# EAGLE design PlacaAquisicao (EAGLE 9.6.2)

## Sheet 1 of 2
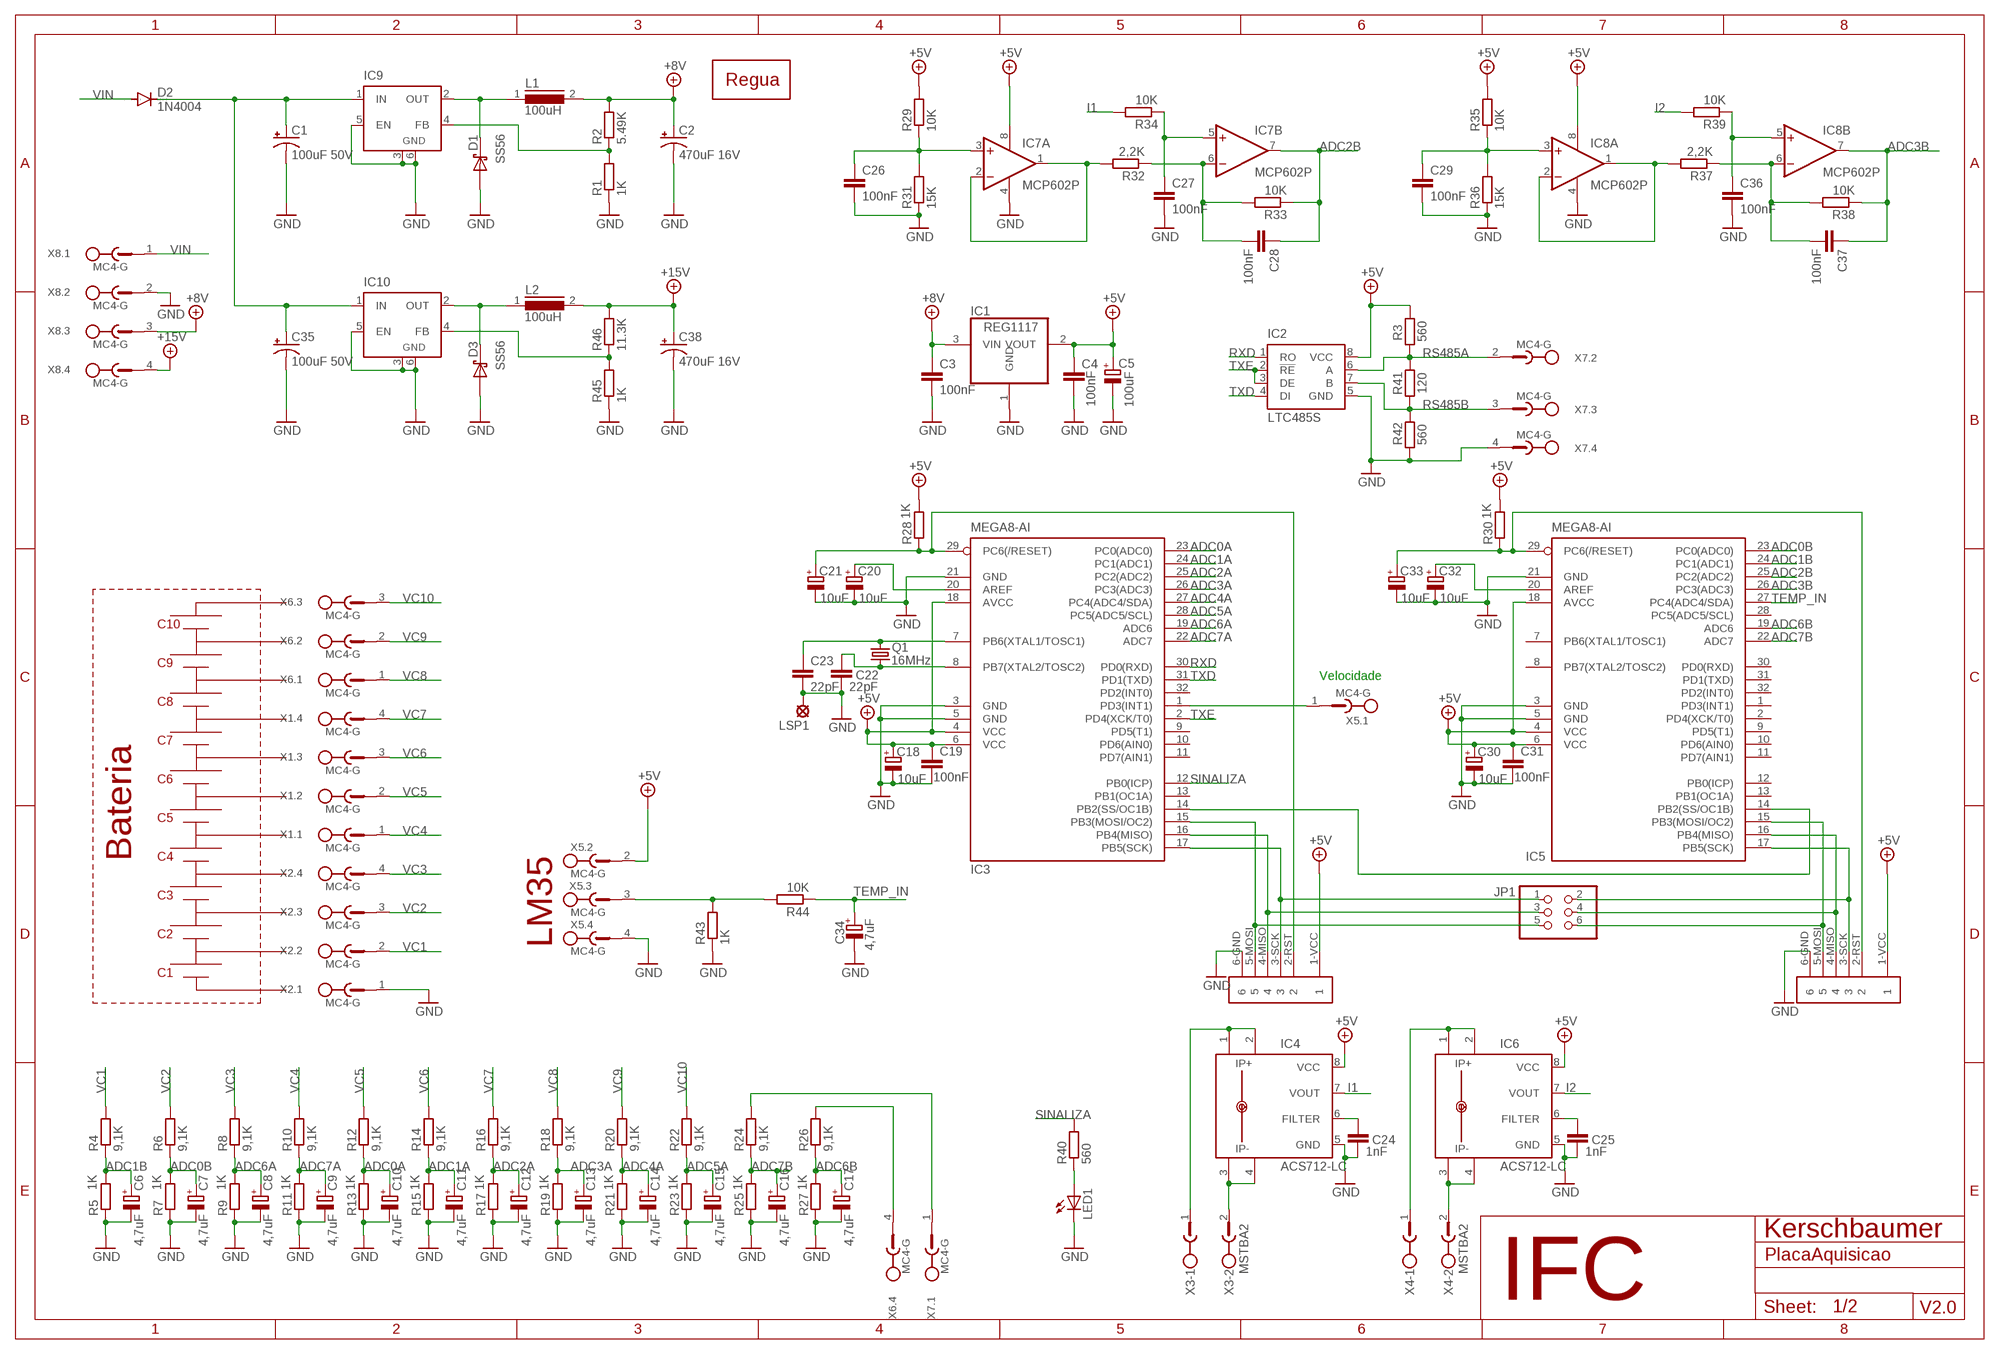
[diagram p0: schematic, sheet 1]

### Parts
C1  100uF 50V  CPOL-USE2.5-7  [E2,5-7]
C2  470uF 16V  CPOL-USE2.5-7  [E2,5-7]
C3  100nF  C-EU050-025X075  [C050-025X075]
C4  100nF  C-EU050-025X075  [C050-025X075]
C5  100uF  CPOL-EUE2.5-6  [E2,5-6]
C6  4,7uF  CPOL-EUE2.5-6  [E2,5-6]
C7  4,7uF  CPOL-EUE2.5-6  [E2,5-6]
C8  4,7uF  CPOL-EUE2.5-6  [E2,5-6]
C9  4,7uF  CPOL-EUE2.5-6  [E2,5-6]
C10  4,7uF  CPOL-EUE2.5-6  [E2,5-6]
C11  4,7uF  CPOL-EUE2.5-6  [E2,5-6]
C12  4,7uF  CPOL-EUE2.5-6  [E2,5-6]
C13  4,7uF  CPOL-EUE2.5-6  [E2,5-6]
C14  4,7uF  CPOL-EUE2.5-6  [E2,5-6]
C15  4,7uF  CPOL-EUE2.5-6  [E2,5-6]
C16  4,7uF  CPOL-EUE2.5-6  [E2,5-6]
C17  4,7uF  CPOL-EUE2.5-6  [E2,5-6]
C18  10uF  CPOL-EUE2.5-6  [E2,5-6]
C19  100nF  C-EU050-025X075  [C050-025X075]
C20  10uF  CPOL-EUE2.5-6  [E2,5-6]
C21  10uF  CPOL-EUE2.5-6  [E2,5-6]
C22  22pF  C-EU025-025X050  [C025-025X050]
C23  22pF  C-EU025-025X050  [C025-025X050]
C24  1nF  C-EU025-025X050  [C025-025X050]
C25  1nF  C-EU025-025X050  [C025-025X050]
C26  100nF  C-EU050-025X075  [C050-025X075]
C27  100nF  C-EU050-025X075  [C050-025X075]
C28  100nF  C-EU050-025X075  [C050-025X075]
C29  100nF  C-EU050-025X075  [C050-025X075]
C30  10uF  CPOL-EUE2.5-6  [E2,5-6]
C31  100nF  C-EU050-025X075  [C050-025X075]
C32  10uF  CPOL-EUE2.5-6  [E2,5-6]
C33  10uF  CPOL-EUE2.5-6  [E2,5-6]
C34  4,7uF  CPOL-EUE2.5-6  [E2,5-6]
C35  100uF 50V  CPOL-USE2.5-7  [E2,5-7]
C36  100nF  C-EU050-025X075  [C050-025X075]
C37  100nF  C-EU050-025X075  [C050-025X075]
C38  470uF 16V  CPOL-USE2.5-7  [E2,5-7]
D1  SS56  DIODE-SCHOTTKY_  [SMA-DIODE]
D2  1N4004  [DO41-10]
D3  SS56  DIODE-SCHOTTKY_  [SMA-DIODE]
IC1  REG1117  [SOT223]
IC2  LTC485S  [SOIC8]
IC3  MEGA8-AI  [TQFP32-08]
IC4  ACS712-LC  [SOIC8]
IC5  MEGA8-AI  [TQFP32-08]
IC6  ACS712-LC  [SOIC8]
IC7  MCP602P  [DIL08]
IC8  MCP602P  [DIL08]
IC9  LM2596S  [TO263-5]
IC10  LM2596S  [TO263-5]
JP1  PINHD-2X3  [2X03]
L1  100uH  DR125  [DR125]
L2  100uH  DR125  [DR125]
LED1  LED3MM  [LED3MM]
LSP1  LSP10  [LSP10]
P1  SPI  [SPI]
P2  SPI  [SPI]
Q1  16MHz  CRYSTALHC49S  [HC49/S]
R1  1K  R-EU_0207/7  [0207/7]
R2  5.49K  R-EU_0207/7  [0207/7]
R3  560  R-EU_0207/7  [0207/7]
R4  9,1K  R-EU_0207/7  [0207/7]
R5  1K  R-EU_0207/7  [0207/7]
R6  9,1K  R-EU_0207/7  [0207/7]
R7  1K  R-EU_0207/7  [0207/7]
R8  9,1K  R-EU_0207/7  [0207/7]
R9  1K  R-EU_0207/7  [0207/7]
R10  9,1K  R-EU_0207/7  [0207/7]
R11  1K  R-EU_0207/7  [0207/7]
R12  9,1K  R-EU_0207/7  [0207/7]
R13  1K  R-EU_0207/7  [0207/7]
R14  9,1K  R-EU_0207/7  [0207/7]
R15  1K  R-EU_0207/7  [0207/7]
R16  9,1K  R-EU_0207/7  [0207/7]
R17  1K  R-EU_0207/7  [0207/7]
R18  9,1K  R-EU_0207/7  [0207/7]
R19  1K  R-EU_0207/7  [0207/7]
R20  9,1K  R-EU_0207/7  [0207/7]
R21  1K  R-EU_0207/7  [0207/7]
R22  9,1K  R-EU_0207/7  [0207/7]
R23  1K  R-EU_0207/7  [0207/7]
R24  9,1K  R-EU_0207/7  [0207/7]
R25  1K  R-EU_0207/7  [0207/7]
R26  9,1K  R-EU_0207/7  [0207/7]
R27  1K  R-EU_0207/7  [0207/7]
R28  1K  R-EU_0207/7  [0207/7]
R29  10K  R-EU_0207/7  [0207/7]
R30  1K  R-EU_0207/7  [0207/7]
R31  15K  R-EU_0207/7  [0207/7]
R32  2,2K  R-EU_0207/7  [0207/7]
R33  10K  R-EU_0207/7  [0207/7]
R34  10K  R-EU_0207/7  [0207/7]
R35  10K  R-EU_0207/7  [0207/7]
R36  15K  R-EU_0207/7  [0207/7]
R37  2,2K  R-EU_0207/7  [0207/7]
R38  10K  R-EU_0207/7  [0207/7]
R39  10K  R-EU_0207/7  [0207/7]
R40  560  R-EU_0207/7  [0207/7]
R41  120  R-EU_0207/7  [0207/7]
R42  560  R-EU_0207/7  [0207/7]
R43  1K  R-EU_0207/7  [0207/7]
R44  10K  R-EU_0207/7  [0207/7]
R45  1K  R-EU_0207/7  [0207/7]
R46  11.3K  R-EU_0207/7  [0207/7]
U$1  REGUA  [REGUA]
X1  MC4-G  [MC4-G]
X2  MC4-G  [MC4-G]
X3  MSTBA2  [MSTBA2]
X4  MSTBA2  [MSTBA2]
X5  MC4-G  [MC4-G]
X6  MC4-G  [MC4-G]
X7  MC4-G  [MC4-G]
X8  MC4-G  [MC4-G]

### Nets
+5V: C4.1 C5.+ C18.+ C19.1 C30.+ C31.1 IC1.2(VOUT) IC2.8(VCC) IC3.4(VCC) IC3.6(VCC) IC3.18(AVCC) IC4.8(VCC) IC5.4(VCC) IC5.6(VCC) IC5.18(AVCC) IC6.8(VCC) IC7.8(P:V+) IC8.8(P:V+) P1.1-VCC P2.1-VCC R3.2 R28.2 R29.2 R30.2 R35.2 X5.2
+8V: C2.+ C3.1 IC1.3(VIN) L1.2 R2.2 X8.3
+15V: C38.+ L2.2 R46.2 X8.4
ADC0A: C10.+ IC3.23(PC0(ADC0)) R12.1 R13.2
ADC0B: C7.+ IC5.23(PC0(ADC0)) R6.1 R7.2
ADC1A: C11.+ IC3.24(PC1(ADC1)) R14.1 R15.2
ADC1B: C6.+ IC5.24(PC1(ADC1)) R4.1 R5.2
ADC2A: C12.+ IC3.25(PC2(ADC2)) R16.1 R17.2
ADC2B: C28.1 IC5.25(PC2(ADC2)) IC7.7(B:OUT) R33.1
ADC3A: C13.+ IC3.26(PC3(ADC3)) R18.1 R19.2
ADC3B: C37.1 IC5.26(PC3(ADC3)) IC8.7(B:OUT) R38.1
ADC4A: C14.+ IC3.27(PC4(ADC4/SDA)) R20.1 R21.2
ADC5A: C15.+ IC3.28(PC5(ADC5/SCL)) R22.1 R23.2
ADC6A: C8.+ IC3.19(ADC6) R8.1 R9.2
ADC6B: C17.+ IC5.19(ADC6) R26.1 R27.2
ADC7A: C9.+ IC3.22(ADC7) R10.1 R11.2
ADC7B: C16.+ IC5.22(ADC7) R24.1 R25.2
GND: C1.- C2.- C3.2 C4.2 C5.- C6.- C7.- C8.- C9.- C10.- C11.- C12.- C13.- C14.- C15.- C16.- C17.- C18.- C19.2 C20.- C21.- C22.2 C23.2 C24.2 C25.2 C26.2 C27.2 C29.2 C30.- C31.2 C32.- C33.- C34.- C35.- C36.2 C38.- D1.A D3.A IC1.1(GND) IC2.5(GND) IC3.3(GND) IC3.5(GND) IC3.21(GND) IC4.5(GND) IC5.3(GND) IC5.5(GND) IC5.21(GND) IC6.5(GND) IC7.4(P:V-) IC8.4(P:V-) IC9.3(GND) IC9.5(EN) IC9.6(GND) IC10.3(GND) IC10.5(EN) IC10.6(GND) LED1.K(C) LSP1.MP P1.6-GND P2.6-GND R1.1 R5.1 R7.1 R9.1 R11.1 R13.1 R15.1 R17.1 R19.1 R21.1 R23.1 R25.1 R27.1 R31.1 R36.1 R42.1 R43.1 R45.1 X2.1 X5.4 X7.4 X8.2
I1: IC4.7(VOUT) R34.2
I2: IC6.7(VOUT) R39.2
N$1: C1.+ C35.+ D2.C IC9.1(IN) IC10.1(IN)
N$2: IC9.4(FB) R1.2 R2.1
N$3: D1.C IC9.2(OUT) L1.1
N$4: C20.+ IC3.20(AREF)
N$5: IC3.14(PB2(SS/OC1B)) IC5.14(PB2(SS/OC1B))
N$6: C23.1 IC3.7(PB6(XTAL1/TOSC1)) Q1.2
N$7: C22.1 IC3.8(PB7(XTAL2/TOSC2)) Q1.1
N$8: C21.+ IC3.29(PC6(/RESET)) P1.2-RST R28.1
N$9: IC4.3(IP-) IC4.4(IP-1) X3.2
N$10: R26.2 X6.4
N$11: IC6.3(IP-) IC6.4(IP-1) X4.2
N$12: IC6.1(IP+) IC6.2(IP+1) X4.1
N$13: C24.1 IC4.6(FILTER)
N$14: C32.+ IC5.20(AREF)
N$15: IC3.17(PB5(SCK)) JP1.1 P1.3-SCK
N$16: IC3.16(PB4(MISO)) JP1.3 P1.4-MISO
N$17: C33.+ IC5.29(PC6(/RESET)) P2.2-RST R30.1
N$18: IC4.1(IP+) IC4.2(IP+1) X3.1
N$19: C25.1 IC6.6(FILTER)
N$20: IC3.1(PD3(INT1)) X5.1
N$21: R24.2 X7.1
N$22: IC7.1(A:OUT) IC7.2(A:-IN) R32.2
N$23: C26.1 IC7.3(A:+IN) R29.1 R31.2
N$24: C28.2 IC7.6(B:-IN) R32.1 R33.2
N$25: C27.1 IC7.5(B:+IN) R34.1
N$26: IC8.1(A:OUT) IC8.2(A:-IN) R37.2
N$27: C29.1 IC8.3(A:+IN) R35.1 R36.2
N$28: C37.2 IC8.6(B:-IN) R37.1 R38.2
N$29: C36.1 IC8.5(B:+IN) R39.1
N$30: IC3.15(PB3(MOSI/OC2)) JP1.5 P1.5-MOSI
N$31: LED1.A R40.1
N$32: IC5.17(PB5(SCK)) JP1.2 P2.3-SCK
N$33: IC5.16(PB4(MISO)) JP1.4 P2.4-MISO
N$34: IC5.15(PB3(MOSI/OC2)) JP1.6 P2.5-MOSI
N$35: R43.2 R44.2 X5.3
N$36: IC10.4(FB) R45.2 R46.1
N$37: D3.C IC10.2(OUT) L2.1
RS485A: IC2.6(A) R3.1 R41.2 X7.2
RS485B: IC2.7(B) R41.1 R42.2 X7.3
RXD: IC2.1(RO) IC3.30(PD0(RXD))
SINALIZA: IC3.12(PB0(ICP)) R40.2
TEMP_IN: C34.+ IC5.27(PC4(ADC4/SDA)) R44.1
TXD: IC2.4(DI) IC3.31(PD1(TXD))
TXE: IC2.2(!RE) IC2.3(DE) IC3.2(PD4(XCK/T0))
VC1: R4.2 X2.2
VC2: R6.2 X2.3
VC3: R8.2 X2.4
VC4: R10.2 X1.1
VC5: R12.2 X1.2
VC6: R14.2 X1.3
VC7: R16.2 X1.4
VC8: R18.2 X6.1
VC9: R20.2 X6.2
VC10: R22.2 X6.3
VIN: D2.A X8.1
Unconnected: IC3.9(PD5(T1)) IC3.10(PD6(AIN0)) IC3.11(PD7(AIN1)) IC3.13(PB1(OC1A)) IC3.32(PD2(INT0)) IC5.1(PD3(INT1)) IC5.2(PD4(XCK/T0)) IC5.7(PB6(XTAL1/TOSC1)) IC5.8(PB7(XTAL2/TOSC2)) IC5.9(PD5(T1)) IC5.10(PD6(AIN0)) IC5.11(PD7(AIN1)) IC5.12(PB0(ICP)) IC5.13(PB1(OC1A)) IC5.28(PC5(ADC5/SCL)) IC5.30(PD0(RXD)) IC5.31(PD1(TXD)) IC5.32(PD2(INT0))

### Notes on the sheet
- C10
- C9
- Velocidade
- C8
- C7
- C6
- C5
- Bateria | C4
- C3
- C2
- LM35
- C1
- Kerschbaumer
- IFC
- V2.0

## Sheet 2 of 2
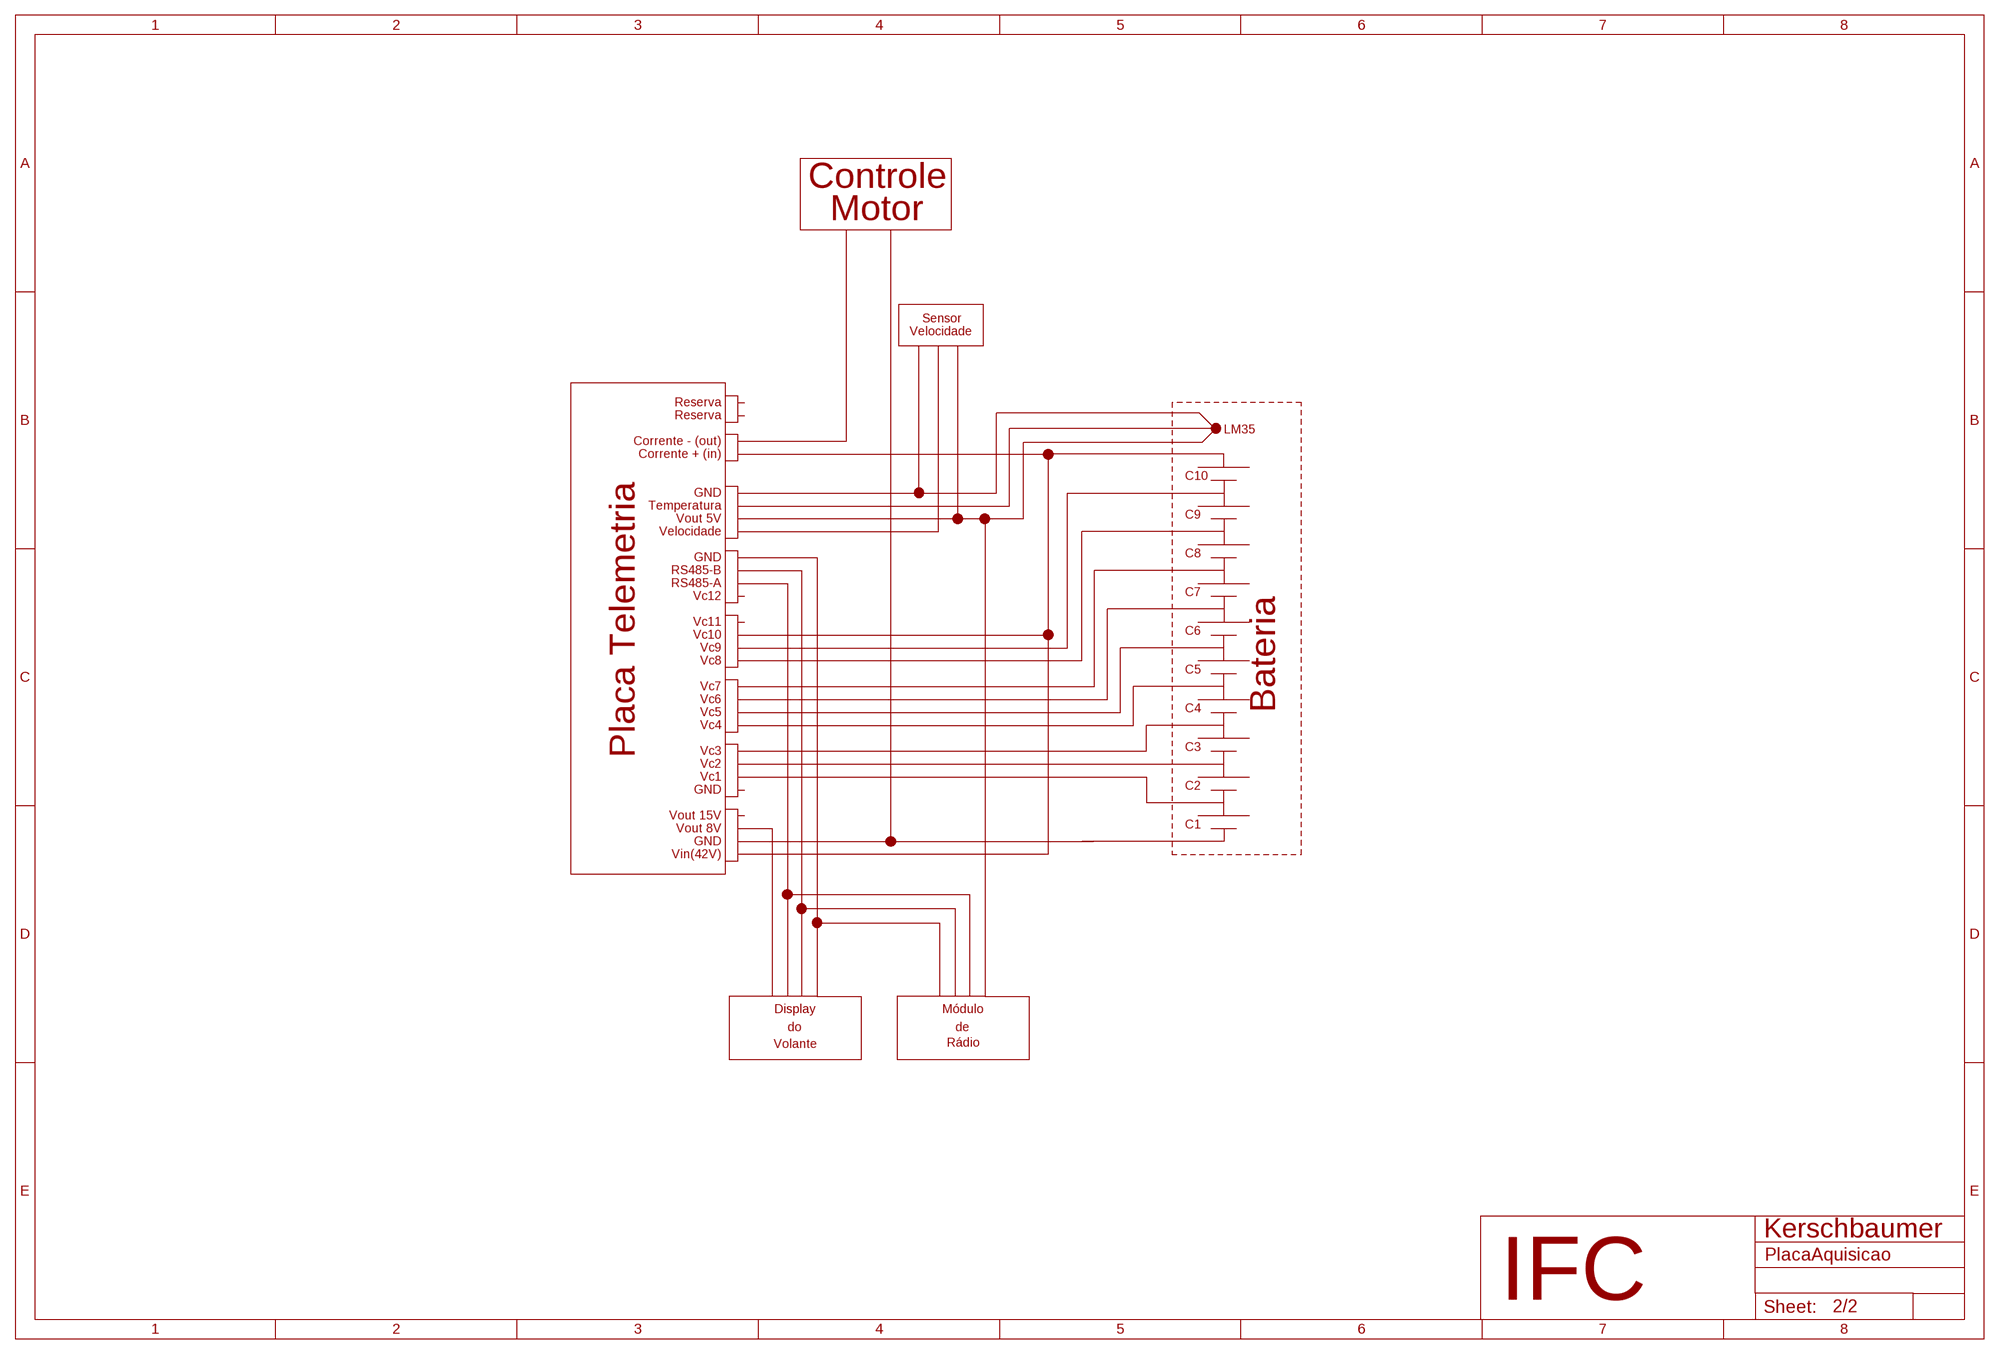
[diagram p1: schematic, sheet 2]

### Notes on the sheet
- Controle
- Motor
- Sensor
- Velocidade
- Reserva
- Reserva
- Corrente - (out) | LM35
- Corrente + (in)
- C10
- GND
- Temperatura
- Vout 5V
- C9
- Velocidade
- GND
- C8
- RS485-B
- RS485-A
- Vc12
- C7
- Vc11
- Vc10
- C6
- Vc9
- Vc8
- C5
- Vc7
- Vc6
- Vc5
- C4 | Bateria
- Vc4
- Vc3
- C3
- Placa Telemetria | Vc2
- Vc1
- GND
- C2
- Vout 15V
- Vout 8V
- C1
- GND
- Vin(42V)
- Display | Módulo
- do | de
- Volante | Rádio
- Kerschbaumer
- IFC

## Library data of the parts
C1 C2 C35 C38 = rcl:CPOL-US: POLARIZED CAPACITOR, American symbol; SPICEPREFIX: C
C3 C4 C19 C22-C29 C31 C36 C37 = rcl:C-EU: CAPACITOR, European symbol; SPICEPREFIX: C
C5-C18 C20 C21 C30 C32-C34 = rcl:CPOL-EU: POLARIZED CAPACITOR, European symbol; SPICEPREFIX: C
D1 D3 = ,RK_SteveMarple:DIODE-SCHOTTKY
D2 = diode:1N4004: DIODE general purpose rectifier, 1 A
IC1 = burr-brown:REG1117: 800mA and 1A Low Dropout (LDO) Positive Regulator 1.8V, 2.5V, 2.85V, 3.3V, 5V, and Adj; MPN: REG1117; OC_FARNELL: 1097566; OC_NEWARK: 14P6981
IC2 = linear-technology:LTC485: Low Power RS485 Interface Transceiver Source: http://www.linear.com/pc/downloadDocument.do?navId=H0,C1,C1007,C1017,P2064,D1718; OC_FARNELL: unknown; OC_NEWARK: unknown
IC3 IC5 = atmel:MEGA8: MICROCONTROLLER 8 Kbytes FLASH, 1 kbytes SRAM, 512 bytes EEPROM, USART, 6-channel 10 bit ADC, 2-channel 8 bit ADC Pin compatible with Atmega48, ATMega88, ATMega168 Source: avr.lbr; MPN: ATMEGA8-16AU; OC_FARNELL: 9171371; OC_NEWARK: 73M8863
IC4 IC6 = allegro-2:ACS712-LC
IC7 IC8 = ,RK_outros:MCP602: OP AMP
IC9 IC10 = linear:LM2596S: STEP-DOWN VOLTAGE REGULATOR
JP1 = pinhead:PINHD-2X3: PIN HEADER
L1 L2 = inductors:DR125: High Power Density, High Efficiency, Shielded Inductors Source: coiltronics_dr_series.pdf; SPICEPREFIX: L
LED1 = ,RK_outros:LED: LED OSRAM: - CHIPLED LG R971, LG N971, LY N971, LG Q971, LY Q971, LO R971, LY R971 LH N974, LH R974 LS Q976, LO Q976, LY Q976 LO Q996 - Hyper CHIPLED LW Q18S LB Q993, LB Q99A, LB R99A - SideLED LS A670, LO A670, LY A670, LG A670, LP A670 LB A673, LV A673, LT A673, LW A673 LH A674 LY A675 LS A676, LA A676, LO A676, LY A676, LW A676 LS A679, LY A679, LG A679 - Hyper Micro SIDELED® LS Y876, LA Y876, LO Y876, LY Y876 LT Y87S - SmartLED LW L88C, LW L88S LB L89C, LB L89S, LG L890 LS L89K, LO L89K, LY L89K LS L896, LA L896, LO L896, LY L896 - TOPLED LS T670, LO T670, LY T670, LG T670, LP T670 LSG T670, LSP T670, LSY T670, LOP T670, LYG T670 LG T671, LOG T671, LSG T671 LB T673, LV T673, LT T673, LW T673 LH T674 LS T676, LA T676, LO T676, LY T676, LB T676, LH T676, LSB T676, LW T676 LB T67C, LV T67C, LT T67C, LS T67K, LO T67K, LY T67K, LW E67C LS E67B, LA E67B, LO E67B, LY E67B, LB E67C, LV E67C, LT E67C LW T67C LS T679, LY T679, LG T679 LS T770, LO T770, LY T770, LG T770, LP T770 LB T773, LV T773, LT T773, LW T773 LH T774 LS E675, LA E675, LY E675, LS T675 LS T776, LA T776, LO T776, LY T776, LB T776 LHGB T686 LT T68C, LB T68C - Hyper Mini TOPLED® LB M676 - Mini TOPLED Santana® LG M470 LS M47K, LO M47K, LY M47K Source: http://www.osram.convergy.de - LUMILED® LXK2-PW12-R00, LXK2-PW12-S00, LXK2-PW14-U00, LXK2-PW14-V00 LXK2-PM12-R00, LXK2-PM12-S00, LXK2-PM14-U00 LXK2-PE12-Q00, LXK2-PE12-R00, LXK2-PE12-S00, LXK2-PE14-T00, LXK2-PE14-U00 LXK2-PB12-K00, LXK2-PB12-L00, LXK2-PB12-M00, LXK2-PB14-N00, LXK2-PB14-P00, LXK2-PB14-Q00 LXK2-PR12-L00, LXK2-PR12-M00, LXK2-PR14-Q00, LXK2-PR14-R00 LXK2-PD12-Q00, LXK2-PD12-R00, LXK2-PD12-S00 LXK2-PH12-R00, LXK2-PH12-S00 LXK2-PL12-P00, LXK2-PL12-Q00, LXK2-PL12-R00 Source: www.luxeon.com
LSP1 = solpad:LSP10: SOLDER PAD drill 1.0 mm, distributor Buerklin, 12H555
P1 P2 = ,RK_outros:SPI
Q1 = crystal:CRYSTAL: CRYSTAL; OC_FARNELL: 1667008; OC_NEWARK: unknown
R1-R46 = rcl:R-EU_: RESISTOR, European symbol; SPICEPREFIX: R
U$1 = ,RK_outros:REGUA
X1 X2 X5-X8 = con-phoenix-381_l:MC4-G: Mini-Combicon 3.81mm horizontal 4-polig MC 1,5/4-G-3,81 Artikel-Nr. 1803293 mit Gegenstecker MC 1,5/4-ST-3,81 Artikel-Nr. 1803594
X3 X4 = con-phoenix-508:MSTBA2: PHOENIX; MF: FARNELL; MPN: 1757242; OC_FARNELL: 3705171; OC_NEWARK: 71C4161

## Board
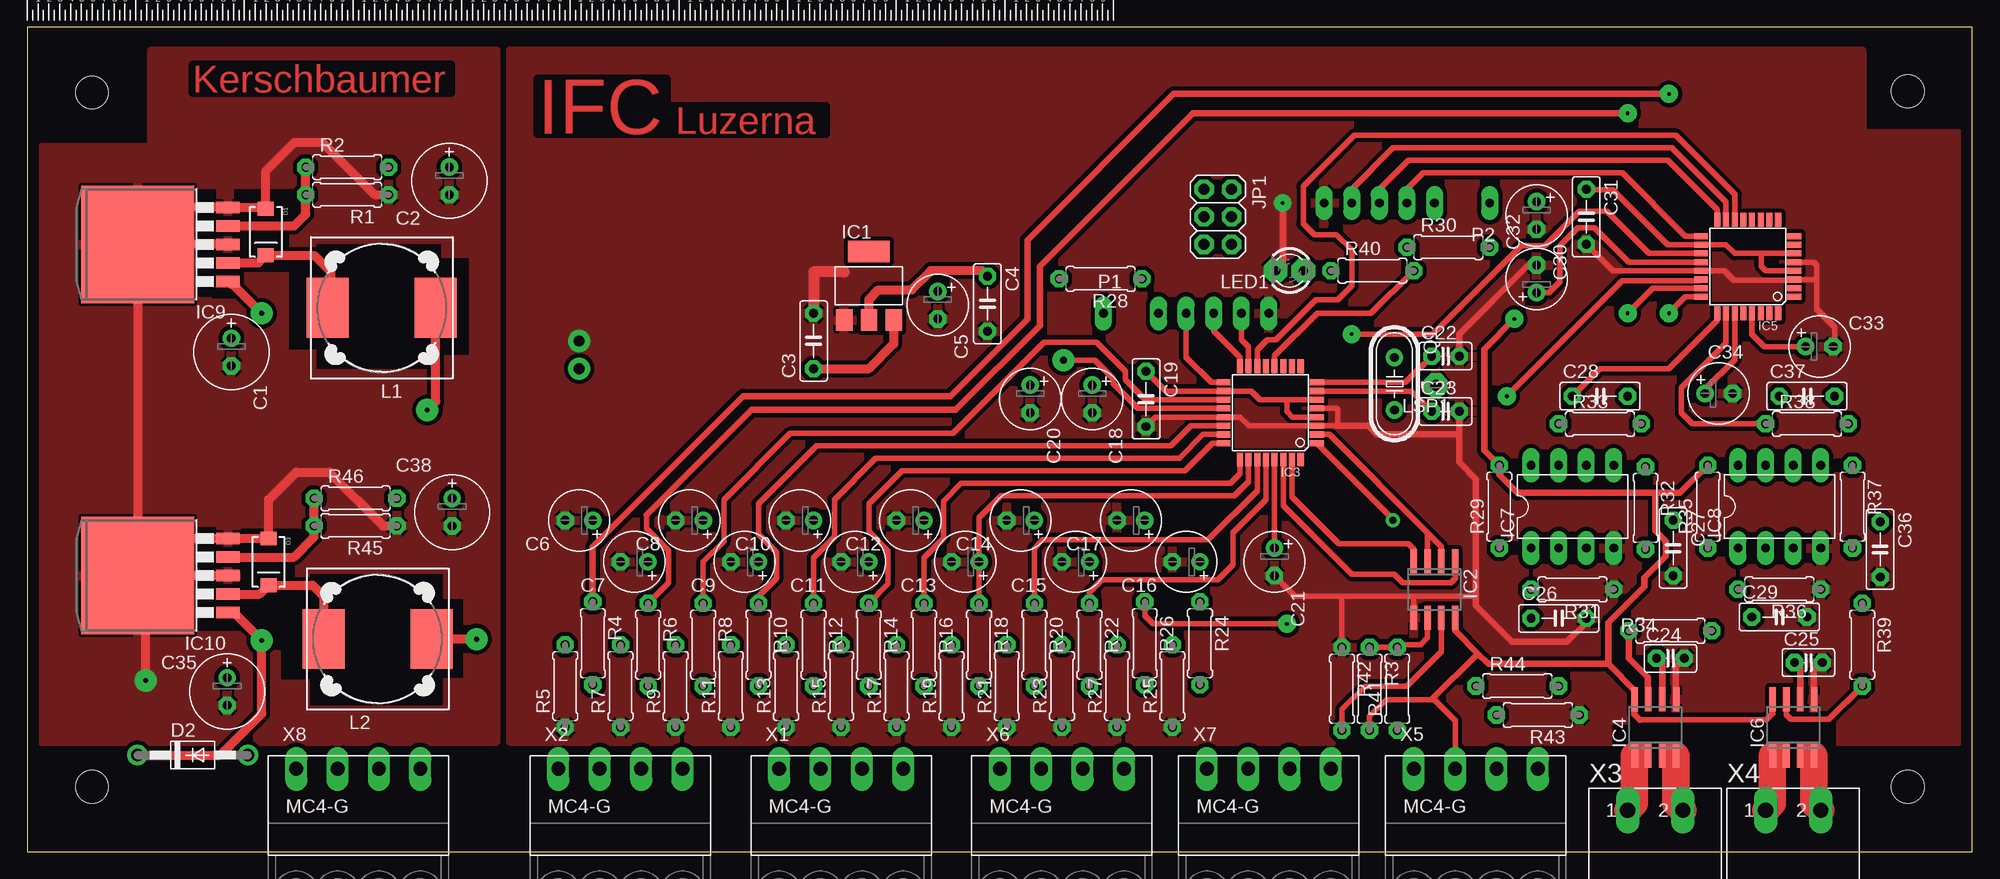
[diagram p2: board, top side]
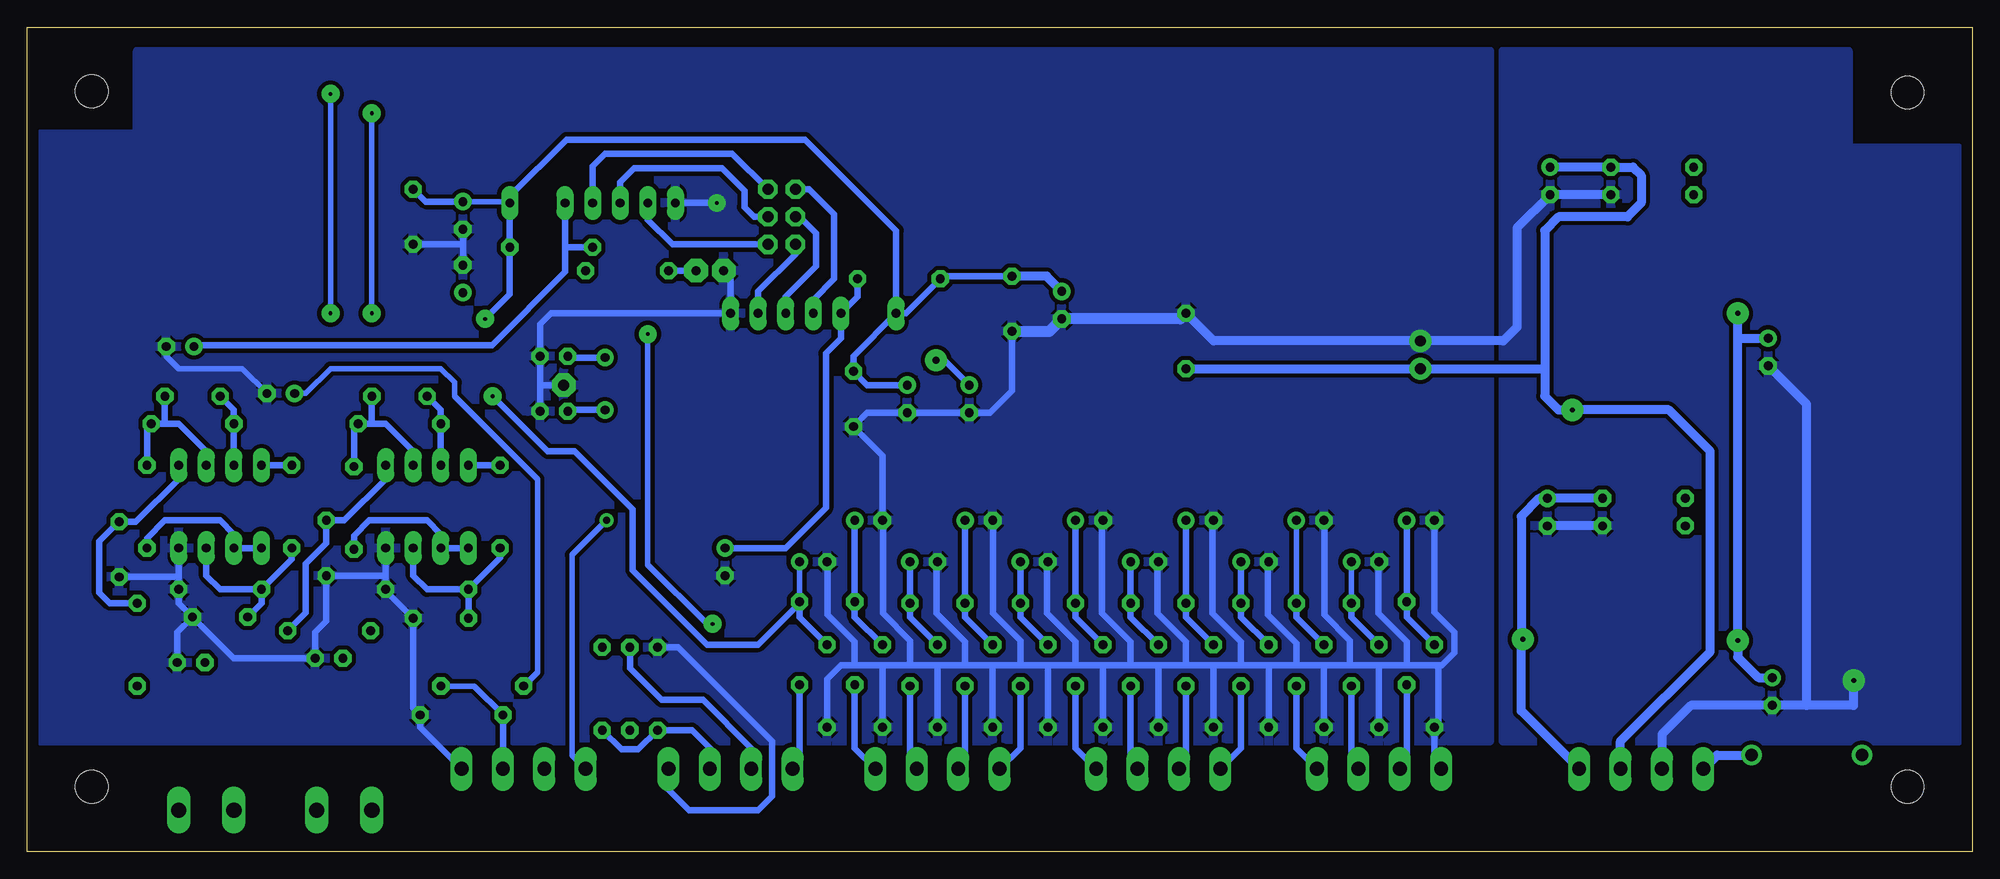
[diagram p3: board, bottom side, seen from below]

Size 179.05 x 75.87 mm. Coordinates in mm from the lower left corner, seen from the top.
Outline: 0,0 179.05,0 179.05,75.87 0,75.87 0,0
Copper layers (1*16): Top 0.035mm / dielectric 1.5mm / Bottom 0.035mm
Design rules "default *": minimum track width 20mil, minimum drill 0.35mm, track to track 15mil, track to pad 15mil, pad to pad 15mil, via to via 15mil, smd to smd 15mil, copper to edge 40mil, drill to drill 6mil, minimum pad ring 15mil, minimum via ring 8mil, stop-mask expansion 4mil, vias tented up to drill 0mil, thermal gap 10mil
Holes 3 mm at 5.97,69.85 5.97,5.97 173.1,69.98 173.1,5.97
tRestrict: area 15.2,51.1 to 17.4,61; area 19.1,53.3 to 24.1,61; area 26.7,44.4 to 38.1,55.9; area 36.8,45.7 to 40.6,54.6; area 24.1,46.2 to 29.6,54.6; area 15.4,20.3 to 17.4,29.8; area 19.7,22.5 to 24.6,29.7; area 26,13.5 to 38.2,25.5; area 37.3,16 to 40.1,23.2; area 23.4,15.9 to 27.8,24.1; area 17.3,20.3 to 19.3,21.1; area 17,50.9 to 18.9,51.6; 2 more areas

### Footprints (pad centres in the part's own frame; a part is rotated, then mirrored left to right if it is on the bottom)
E2,5-7 = drill 0.813 pad 1.6: + -1.27,0 | drill 0.813 pad 1.6 octagon: - 1.27,0
C050-025X075 = drill 0.813 octagon: 1 -2.54,0; 2 2.54,0
E2,5-6 = drill 0.813 pad 1.6: + -1.27,0 | drill 0.813 pad 1.6 octagon: - 1.27,0
C025-025X050 = drill 0.813 octagon: 1 -1.27,0; 2 1.27,0
SMA-DIODE = smd 1.27 x 1.47: A -2.15,0; C 2.15,0
DO41-10 = drill 1.118: A 5.08,0; C -5.08,0
SOT223 = smd 1.499 x 2.007: 1 -2.261,-3.15; 2 0.025,-3.15; 3 2.311,-3.15 | smd 3.81 x 2.007: 4 0,3.15
SOIC8 = smd 0.6 x 2.2: 1 -1.905,-2.6; 2 -0.635,-2.6; 3 0.635,-2.6; 4 1.905,-2.6; 5 1.905,2.6; 6 0.635,2.6; 7 -0.635,2.6; 8 -1.905,2.6
TQFP32-08 = smd 1.27 x 0.559: 1 -4.293,2.8; 2 -4.293,2; 3 -4.293,1.2; 4 -4.293,0.4; 5 -4.293,-0.4; 6 -4.293,-1.2; 7 -4.293,-2; 8 -4.293,-2.8; 17 4.293,-2.8; 18 4.293,-2; 19 4.293,-1.2; 20 4.293,-0.4; 21 4.293,0.4; 22 4.293,1.2; 23 4.293,2; 24 4.293,2.8 | smd 0.559 x 1.27: 9 -2.8,-4.293; 10 -2,-4.293; 11 -1.2,-4.293; 12 -0.4,-4.293; 13 0.4,-4.293; 14 1.2,-4.293; 15 2,-4.293; 16 2.8,-4.293; 25 2.8,4.293; 26 2,4.293; 27 1.2,4.293; 28 0.4,4.293; 29 -0.4,4.293; 30 -1.2,4.293; 31 -2,4.293; 32 -2.8,4.293
DIL08 = drill 0.813 long: 1 -3.81,-3.81; 2 -1.27,-3.81; 3 1.27,-3.81; 4 3.81,-3.81; 5 3.81,3.81; 6 1.27,3.81; 7 -1.27,3.81; 8 -3.81,3.81
TO263-5 = smd 1.067 x 2.159: 1 -3.404,-5.791; 2 -1.702,-5.791; 3 0,-5.791; 4 1.702,-5.791; 5 3.404,-5.791 | smd 10.8 x 10.41: 6 0,2.54
2X03 = drill 1.016 octagon: 1 -2.54,-1.27; 2 -2.54,1.27; 3 0,-1.27; 4 0,1.27; 5 2.54,-1.27; 6 2.54,1.27
DR125 = smd 3.85 x 5.5: 1 -4.975,0; 2 4.975,0
LED3MM = drill 0.813 pad 2.184 octagon: A -1.27,0; K 1.27,0
LSP10 = drill 1.016 pad 2.159 octagon: MP 0,0
SPI = drill 0.813 long: 1-VCC -7.62,0; 2-RST -2.54,0; 3-SCK 0,0; 4-MISO 2.54,0; 5-MOSI 5.08,0; 6-GND 7.62,0
HC49/S = drill 0.813: 1 -2.413,0; 2 2.413,0
0207/7 = drill 0.813 octagon: 1 -3.81,0; 2 3.81,0
MC4-G = drill 1.27 long: 1 -5.715,0; 2 -1.905,0; 3 1.905,0; 4 5.715,0
MSTBA2 = drill 1.397 long: 1 -2.54,5.08; 2 2.54,5.08

### Placement (x,y rotation side)
C1  18.8,45.97 270 top
C2  38.86,61.72 270 top
C3  72.39,46.99 90 top
C4  88.39,50.42 270 top
C5  83.82,50.29 270 top
C6  50.8,30.48 180 top
C7  55.88,26.67 180 top
C8  60.96,30.48 180 top
C9  66.04,26.67 180 top
C10  71.12,30.48 180 top
C11  76.2,26.67 180 top
C12  81.28,30.48 180 top
C13  86.36,26.67 180 top
C14  91.44,30.48 180 top
C15  96.52,26.67 180 top
C16  106.68,26.67 180 top
C17  101.6,30.48 180 top
C18  98.04,41.66 270 top
C19  103,41.66 270 top
C20  92.33,41.66 270 top
C21  114.81,26.67 270 top
C22  130.56,45.59 0 top
C23  130.56,40.51 0 top
C24  151.26,17.78 0 top
C25  163.96,17.4 0 top
C26  140.97,21.46 0 top
C27  151.51,27.94 270 top
C28  144.78,41.91 0 top
C29  161.29,21.59 0 top
C30  138.94,58.55 270 top
C31  143.51,58.42 270 top
C32  138.94,52.7 90 top
C33  164.97,46.48 0 top
C34  155.7,42.16 0 top
C35  18.42,14.73 270 top
C36  170.56,27.81 270 top
C37  163.83,41.91 0 top
C38  39.12,31.24 270 top
D1  21.97,57.02 270 top
D2  15.24,8.89 0 top
D3  22.23,26.67 270 top
IC1  77.47,52.07 0 top
IC2  129.54,24.13 180 top
IC3  114.43,40.39 180 top
IC4  149.86,11.43 0 top
IC5  158.37,53.85 180 top
IC6  162.56,11.43 0 top
IC7  142.24,31.75 0 top
IC8  161.29,31.75 0 top
IC9  12.7,55.88 90 top
IC10  12.7,25.4 90 top
JP1  109.6,58.42 270 top
L1  32.64,50.04 0 top
L2  32.26,19.56 0 top
LED1  116.21,53.47 180 top
LSP1  129.67,42.93 180 top
P1  106.68,49.53 0 top
P2  127,59.69 180 top
Q1  125.86,43.05 270 top
R1  29.46,60.45 180 top
R2  29.46,62.99 0 top
R3  123.57,14.99 270 top
R4  52.07,19.18 270 top
R5  49.53,15.24 90 top
R6  57.15,19.05 270 top
R7  54.61,15.24 90 top
R8  62.23,19.05 270 top
R9  59.69,15.24 90 top
R10  67.31,19.05 270 top
R11  64.77,15.24 90 top
R12  72.39,19.05 270 top
R13  69.85,15.24 90 top
R14  77.47,19.05 270 top
R15  74.93,15.24 90 top
R16  82.55,19.05 270 top
R17  80.01,15.24 90 top
R18  87.63,19.05 270 top
R19  85.09,15.24 90 top
R20  92.71,19.05 270 top
R21  90.17,15.24 90 top
R22  97.79,19.05 270 top
R23  95.25,15.24 90 top
R24  107.95,19.18 270 top
R25  105.41,15.24 90 top
R26  102.87,19.18 270 top
R27  100.33,15.24 90 top
R28  98.81,52.7 180 top
R29  135.51,31.75 90 top
R30  130.81,55.63 0 top
R31  142.24,24.13 180 top
R32  148.97,31.62 270 top
R33  144.78,39.37 0 top
R34  151.26,20.32 180 top
R35  154.69,31.75 90 top
R36  161.29,24.13 180 top
R37  168.02,31.75 270 top
R38  163.83,39.37 0 top
R39  168.91,19.05 270 top
R40  123.83,53.47 0 top
R41  126.11,14.99 90 top
R42  121.03,14.99 270 top
R43  139.06,12.57 180 top
R44  137.16,15.24 0 top
R45  30.23,29.97 180 top
R46  30.23,32.51 0 top
U$1  0,77.22 0 top
X1  74.93,7.62 0 top
X2  54.61,7.62 0 top
X3  149.86,-1.27 0 top
X4  162.56,-1.27 0 top
X5  133.35,7.62 0 top
X6  95.25,7.62 0 top
X7  114.3,7.62 0 top
X8  30.48,7.62 0 top

### Tracks (layer width: path | path; a pad name or v marks a point on that pad's centre or on a via)
+5V  (via drill 0.35 pad 1.65)
  Top 0.508: C31.1 143.54,60.93 145.95,60.93 151.03,55.85 IC5.18 156.37,55.85 157.17,55.05 159.64,55.05 | IC5.6 159.64,55.05 | IC5.4 160.04,53.45 159.64,53.85 159.64,55.05 | C19.1 104.81,42.39 IC3.18 112.68,42.39 113.48,41.59 115.95,41.59 | IC3.6 115.95,41.59 | IC3.4 116.48,39.99 115.95,40.51 115.95,41.59 | 160.66,12.7 160.07,12.12 148.46,12.12 | R3.2 123.57,12.45 125.09,13.97 129.27,13.97 | 129.27,13.97 133.53,18.23 | X5.2 131.44,12.06 129.54,13.97 129.27,13.97
  Top 0.61: IC2.8 131.44,20.32 133.53,18.23 134.49,17.27 145.54,17.27 | IC6.8 160.66,12.7 | 148.46,12.12 147.96,12.63 IC4.8 147.96,14.86 145.54,17.27 | R35.2 152.15,33.02 149.86,33.02 | 149.86,33.02 137.16,33.02 135.51,34.67 R29.2 134.11,36.96 134.11,46.23 v136.91,49.02 | 149.86,33.02 149.86,29.52 150.83,28.55 150.83,27.2 148.84,25.22 148.84,24.38 145.54,21.08 145.54,17.27
  Top 0.813: 77.47,48.95 77.47,50.8 78.36,51.69 81.41,51.69 83.19,53.47 87.88,53.47 C4.1
  Top 1.016: IC1.2 77.47,48.95
  Bottom 0.508: P2.1-VCC 134.75,59.82 C30.+
  Bottom 0.61: IC8.8 R35.2 | R29.2 IC7.8 | C31.1 142.37,59.82 C30.+ | C18.+ 101.73,42.93 C19.1 103,45.59 P1.1-VCC | P1.1-VCC 98.17,49.53 R28.2 94.74,52.96 C4.1 | P1.1-VCC 99.06,57.15 107.44,65.53 129.41,65.53 134.62,60.32 P2.1-VCC R30.2 134.62,51.31 v136.91,49.02
  Bottom 0.813: C5.+ 85.22,52.96 C4.1
+8V  (via drill 0.45 pad 2.03, 1 pad 2.03)
  Top 0.813: 79.76,48.89 79.76,46.74 77.47,44.45 C3.1 | v36.83,40.64 37.61,41.42 L1.2
  Top 1.016: IC1.3 79.76,48.89
  Bottom 0.813: C2.+ R2.2 31.24,62.99 30.48,62.23 30.48,59.69 31.75,58.42 38.1,58.42 39.37,57.15 39.37,44.45 | X8.3 32.39,10.16 24.13,18.41 24.13,36.83 27.94,40.64 v36.83,40.64 38.1,40.64 39.37,41.91 39.37,44.45 | 39.37,44.45 v50.8,44.45 C3.1
+15V  (via drill 0.45 pad 2.03)
  Top 0.813: v41.38,19.56 L2.2
  Bottom 0.813: R46.2 C38.+ 39.88,32.51 41.53,30.86 41.53,19.56 | 41.53,19.56 41.53,12.95 X8.4 | 41.53,19.56 v41.38,19.56
ADC0A
  Top 0.508: IC3.23 108.24,38.39 106.05,36.2 78.11,36.2 74.3,32.38 74.3,28.96 72.39,27.05 R12.1
  Bottom 0.61: R13.2 72.39,21.59 R12.1 C10.+
ADC0B  (via drill 0.35 pad 1.65)
  Top 0.508: IC5.23 149.64,51.85 v147.32,49.53 | 57.02,30.99 57.02,29.72 59.06,27.69 59.06,24.77 R6.1
  Top 0.61: 57.02,30.99 66.68,40.64 85.47,40.64 93.22,48.39 93.22,53.85 107.31,67.95 v147.32,67.95
  Bottom 0.508: v147.32,49.53 v147.32,67.95 | C7.+ R6.1
  Bottom 0.61: R7.2 57.15,21.59 R6.1
ADC1A
  Top 0.508: IC3.24 109.1,37.59 109.09,37.59 106.55,35.05 80.52,35.05 77.47,32 77.47,29.46 79.25,27.69 79.25,24.64 R14.1
  Bottom 0.61: R15.2 77.47,21.59 R14.1 C11.+
ADC1B  (via drill 0.35 pad 1.65)
  Top 0.508: IC5.24 152.65,51.05 v151.13,49.53
  Top 0.61: v151.13,69.72 105.54,69.72 92.08,56.26 92.08,48.97 85.01,41.91 65.91,41.91 52.07,28.07 R4.1
  Bottom 0.508: v151.13,49.53 v151.13,69.72
  Bottom 0.61: R5.2 52.07,21.59 R4.1 C6.+
ADC2A
  Top 0.508: IC3.25 111.63,34.79 110.74,33.91 86.36,33.91 86.23,33.91 85.98,33.91 84.33,32.26 84.33,28.83 82.55,27.05 R16.1
  Bottom 0.61: R17.2 82.55,21.59 R16.1 C12.+
ADC2B
  Top 0.508: C28.1 144.78,44.45 151.13,44.45 155.57,48.89 IC5.25
  Bottom 0.61: C28.1 140.97,40.64 R33.1 IC7.7
ADC3A
  Top 0.508: IC3.26 112.4,36.06 112.4,34.04 111.12,32.77 89.66,32.77 87.63,30.73 R18.1
  Bottom 0.61: R19.2 87.63,21.59 R18.1 C13.+
ADC3B
  Top 0.508: R38.1 153.29,39.37 152.27,40.39 152.27,42.67 156.37,46.77 IC5.26
  Bottom 0.61: IC8.7 R38.1 160.02,40.64 C37.1
ADC4A
  Top 0.508: IC3.27 113.23,33.22 108.71,28.7 93.47,28.7 92.71,27.94 R20.1
  Bottom 0.61: R21.2 92.71,21.59 R20.1 C14.+
ADC5A
  Top 0.508: IC3.28 114.03,32.37 111,29.34 111,26.42 109.6,25.02 98.93,25.02 97.79,23.88 R22.1
  Bottom 0.61: R23.2 97.79,21.59 R22.1 C15.+
ADC6A
  Top 0.508: IC3.19 102.94,41.59 101.09,43.43 101.09,44.2 98.43,46.86 93.6,46.86 85.22,38.48 70.23,38.48 64.14,32.38 64.14,28.57 62.23,26.67 R8.1
  Bottom 0.508: R8.1 C8.+
  Bottom 0.61: R9.2 62.23,21.59 R8.1
ADC6B  (via drill 0.35 pad 1.65)
  Top 0.508: IC5.19 149.3,55.05 145.41,58.93 142.88,58.93 139.7,55.75 137.54,55.75 129.41,47.62 v121.92,47.62 | v115.95,20.95 103.63,20.95 102.87,21.72 R26.1
  Bottom 0.508: v115.95,20.95 116.46,20.95 121.92,26.42 v121.92,47.62
  Bottom 0.61: R27.2 102.87,21.59 R26.1 C17.+
ADC7A
  Top 0.508: IC3.22 107.13,39.19 105.28,37.34 72.64,37.34 67.31,32 67.31,29.21 68.96,27.56 68.96,25.15 67.31,23.49 R10.1
  Bottom 0.61: R11.2 67.31,21.59 R10.1 C9.+
ADC7B  (via drill 0.35 pad 1.65)
  Top 0.508: v136.21,41.91 146.81,52.51 146.81,52.52 153.95,52.52 IC5.22
  Bottom 0.508: C16.+ R24.1
  Bottom 0.61: R25.2 107.95,21.59 107.95,22.86 | 107.95,22.86 R24.1 | v136.21,41.91 131.13,36.83 128.65,36.83 123.32,31.5 123.32,25.91 116.46,19.05 111.76,19.05 107.95,22.86
GND  (via drill 0.35 pad 1.65, 0.45 pad 2.03, 1 pad 2.03)
  Top 0.508: C31.2 145.94,53.45 IC5.21 156.23,53.45 157.1,52.58 162.59,52.58 IC5.3 164.53,52.65 164.72,52.83 | C19.2 103.87,39.99 IC3.21 111.65,39.99 112.45,39.19 IC3.3 120.47,39.19 120.65,39.37 120.65,40.64 120.5,40.79 IC3.5 | IC5.5 164.45,54.25 164.72,53.98 164.72,52.83 | IC2.5 127.63,23.37 127.76,23.49 | 127.76,23.49 133.22,23.49 133.35,23.62 | C21.- 116.71,23.49 121.16,23.49 | 121.16,23.49 127.76,23.49 | 164.72,52.83 164.72,49.91 166.37,48.26 166.37,46.61 C33.- | R42.1 121.03,23.37 121.16,23.49
  Top 0.61: C24.2 151.77,17.02 IC4.5 | C25.2 164.47,16.64 IC6.5 | 120.47,39.19 123.45,39.19 124.23,38.41 131.75,38.41 131.83,38.48 C23.2 131.83,35.81 133.35,34.29 133.35,23.62 133.35,22.61 136.65,19.3 141.73,19.3 143.51,21.08 C26.2 | C32.- 138.81,53.85 138.05,53.85 131.83,47.62 C22.2 | v115.57,59.69 115.57,54.1 LED1.K
  Top 0.813: R1.1 32,60.45 27.18,65.28 24.64,65.28 21.97,62.61 D1.A 21.86,59.28 IC9.5 13.11,59.28 12.7,59.69 11.43,58.42 | IC9.3 11.43,55.88 11.43,58.42 | R45.1 32.77,29.97 27.81,34.92 24.77,34.92 22.23,32.38 D3.A 18.51,28.82 IC10.5 11.84,28.8 11.43,29.21 11.43,25.4 | IC10.3 11.43,25.4 | 11.43,25.4 IC10.6 | v10.92,15.75 10.92,24.64 IC10.6 | IC10.6 IC9.6 10.16,57.15 11.43,58.42
  Top 1.016: 75.2,53.33 75.18,53.34 72.39,53.34 C3.2
  Bottom 0.508: 138.94,55.88 C30.- | C34.- 159.26,44.45 165.1,44.45 166.24,45.59 C33.-
  Bottom 0.61: 49.4,17.15 49.15,16.89 49.15,11.81 R5.1 49.53,8.26 X2.1 | R25.1 105.41,15.88 104.14,17.15 102.87,17.15 | 54.61,17.15 57.28,17.15 | 57.28,17.15 59.69,17.15 | 59.69,17.15 62.23,17.15 | 62.23,17.15 64.77,17.15 | 64.77,17.15 67.31,17.15 | 67.31,17.15 69.85,17.15 | 69.85,17.15 72.39,17.15 | 72.39,17.15 74.93,17.15 | 74.93,17.15 77.47,17.15 | 77.47,17.15 80.01,17.15 | 80.01,17.15 82.55,17.15 | 82.55,17.15 85.09,17.15 | 85.09,17.15 87.63,17.15 | 87.63,17.15 90.17,17.15 | 90.17,17.15 92.71,17.15 | 92.71,17.15 95.25,17.15 | 95.25,17.15 97.79,17.15 | 97.79,17.15 100.33,17.15 | 100.33,17.15 102.87,17.15 | R27.1 100.33,17.15 | R23.1 95.25,17.15 | R21.1 90.17,17.15 | R19.1 85.09,17.15 | R17.1 80.01,17.15 | R15.1 74.93,17.15 | R13.1 69.85,17.15 | R7.1 54.61,17.15 | R9.1 59.69,17.15 | R11.1 64.77,17.15 | C6.- 49.53,22.02 47.68,20.17 47.68,18.31 48.84,17.15 49.4,17.15 | 49.4,17.15 52.07,17.15 | 52.07,17.15 54.61,17.15 | 52.07,17.15 52.07,19.3 54.69,21.92 54.69,26.59 C7.- | 57.28,17.15 57.28,19.43 59.65,21.8 59.65,30.44 C8.- | 62.23,17.15 62.23,19.17 64.85,21.79 64.85,26.59 C9.- | 67.31,17.15 67.31,19.3 69.94,21.93 69.94,30.39 C10.- | 72.39,17.15 72.39,19.3 75.01,21.92 75.01,26.59 C11.- | 77.47,17.15 77.47,19.3 80.1,21.93 80.1,30.39 C12.- | 82.55,17.15 82.55,19.3 85.17,21.92 85.17,26.59 C13.- | 87.63,17.15 87.63,19.43 90.13,21.93 90.13,30.44 C14.- | 92.71,17.15 92.71,19.3 95.33,21.92 95.33,26.59 C15.- | 97.79,17.15 97.79,19.43 100.29,21.93 100.29,30.44 C17.- 100.33,36.45 C19.2 101.73,40.39 C18.- C20.- 90.42,40.39 88.39,42.42 C4.2 | 102.87,17.15 102.87,19.3 105.36,21.79 105.36,26.62 C16.- | 165.1,25.4 R36.1 165.1,22.86 C29.2 | 165.1,25.4 IC8.4
  Bottom 0.61: 146.05,25.4 R31.1 146.05,24 C26.2 143.51,13.21 R43.1 142.88,11.43 X5.4 | 146.05,25.4 IC7.4 | 146.05,25.4 C27.2 151.51,21.21 152.53,20.19 C24.2 160.02,17.78 C29.2 | C36.2 165.23,25.27 165.1,25.4 | C31.2 138.94,55.88 | C32.- C30.- | C23.2 131.83,42.93 | 131.83,42.93 C22.2 131.83,48.51 130.81,49.53 P1.6-GND 114.3,52.83 LED1.K | LSP1.MP 131.83,42.93 | C29.2 165.23,20.19 C25.2 | P2.6-GND v115.57,59.69 | R42.1 119.13,18.8 110.49,10.16 110.49,5.08 111.76,3.81 118.11,3.81 120.02,5.71 X7.4
  Bottom 0.813: R45.1 C38.- | R1.1 C2.- 41.91,57.4 41.91,48.26 43.18,46.99 v50.8,46.99 69.85,46.99 C3.2 | 15.24,13.46 10.92,13.46 v10.92,15.75 | 15.24,13.46 C35.- 25.91,13.46 28.58,10.79 X8.2 | 15.24,13.46 15.24,41.15 C1.-
  Bottom 1.016: C3.2 72.9,49.02 C5.- 84.96,47.88 C4.2
  pour Top: 43.18,10.16 43.18,73.66 11.43,73.66 11.43,64.77 1.27,64.77 1.27,10.16
  pour Bottom: 44.45,10.16 177.8,10.16 177.8,66.04 168.91,66.04 168.91,73.66 44.45,73.66
  pour Bottom: 1.27,64.77 1.27,10.16 43.18,10.16 43.18,73.66 11.43,73.66 11.43,64.77
  pour Top: 44.45,73.66 44.45,10.16 177.8,10.16 177.8,66.04 168.91,66.04 168.91,73.66
I1
  Top 0.61: IC4.7 149.2,14.06 149.2,16.04 147.45,17.8 R34.2
I2
  Top 0.508: IC6.7 161.93,12.57 162.33,12.17 165.84,12.17 R39.2
N$1  (via drill 0.45 pad 2.03)
  Top 0.813: IC9.1 18.8,52.17 18.95,52.17 v21.59,49.53 | IC10.1 18.42,21.92 19.1,21.92 v21.59,19.43 21.59,12.7 17.78,8.89 D2.C
  Bottom 0.813: C35.+ 19.69,16 21.59,17.91 v21.59,19.43 21.59,46.99 21.34,47.24 | 21.34,47.24 21.59,47.24 v21.59,49.53 | 21.34,47.24 C1.+
N$2
  Top 0.813: IC9.4 24.56,57.58 25.65,58.67 R1.2 R2.1
N$3
  Top 0.813: IC9.2 21.28,54.18 D1.C 26.41,54.87 27.94,53.34 27.94,50.31 L1.1
N$4  (via drill 0.64 pad 2.03)
  Top 0.508: IC3.20 102.25,40.79 99.95,43.09 99.95,43.56 98.3,45.21 v95.38,45.21
  Bottom 0.508: v95.38,45.21 94.62,45.21 C20.+
N$5
  Top 0.508: IC5.14 157.17,60.51 151.77,65.91 122.17,65.91 117.47,61.21 117.47,57.79 118.49,56.77 120.52,56.77 121.92,55.37 121.92,52.07 120.65,50.8 118.62,50.8 114.94,47.12 114.17,47.12 113.23,46.17 IC3.14
N$6
  Top 0.508: IC3.7 127.41,42.39 C23.1
  Bottom 0.61: Q1.2 129.16,40.64 C23.1
N$7
  Top 0.508: IC3.8 126.88,43.19 C22.1
  Bottom 0.61: Q1.1 129.16,45.47 C22.1
N$8
  Top 0.508: IC3.29 114.83,27.96 C21.+
  Bottom 0.61: R28.1 102.62,51.05 P1.2-RST 104.14,47.24 105.54,45.85 105.54,31.62 109.22,27.94 C21.+
N$9
  Top 0.61: IC4.3 150.5,9.78 151.77,9.78 IC4.4
  Top 2.54: IC4.4 151.77,4.45 X3.2
N$10
  Bottom 0.61: X6.4 102.87,9.53 R26.2
N$11
  Top 0.61: IC6.3 163.2,9.78 164.47,9.78 IC6.4
  Top 2.54: IC6.4 164.47,4.45 X4.2
N$12
  Top 0.61: IC6.1 160.66,9.65 160.78,9.78 161.93,9.78 IC6.2
  Top 2.54: IC6.1 160.66,4.45 X4.1
N$13
  Top 0.61: C24.1 150.5,17.27 IC4.6
N$14
  Top 0.508: C32.+ 140.08,51.43 141.1,52.45 141.1,55.75 142.75,57.4 144.27,57.4 147.43,54.25 IC5.20
N$15
  Top 0.508: IC3.17 108.99,43.19 106.68,45.5 P1.3-SCK
  Bottom 0.61: JP1.1 107.06,60.96 104.78,58.67 104.78,52.7 106.68,50.8 P1.3-SCK
N$16
  Top 0.508: IC3.16 111.63,45.47 109.22,47.88 P1.4-MISO
  Bottom 0.61: P1.4-MISO 109.22,51.05 106.43,53.85 106.43,56.9 107.95,58.42 JP1.3
N$17
  Top 0.508: C33.+ 159.89,46.48 158.77,47.61 IC5.29
  Bottom 0.61: R30.1 129.54,55.63 | P2.2-RST 129.54,55.63 | C33.+ 163.58,46.61 136.27,46.61 129.54,53.34 129.54,55.63
N$18
  Top 0.61: IC4.2 149.22,9.78 147.96,9.78 IC4.1
  Top 2.54: IC4.1 147.96,4.45 X3.1
N$19
  Top 0.61: C25.1 163.2,16.89 IC6.6
N$20  (via drill 0.65 pad 1.3)
  Top 0.508: IC3.1 125.73,30.58 v125.73,30.48
  Bottom 0.508: v125.73,30.48 128.91,27.3 128.91,8.89 X5.1
N$21
  Bottom 0.61: X7.1 107.95,8.26 R24.2
N$22
  Bottom 0.61: IC7.1 IC7.2 140.97,29.21 142.24,30.48 147.57,30.48 148.97,29.08 R32.2
N$23
  Bottom 0.61: R31.2 142.24,24.13 143.51,25.4 IC7.3 | C26.1 R31.2 | R29.1 135.51,27.05 R31.2
N$24
  Bottom 0.61: IC7.6 143.51,36.83 146.05,39.37 147.32,39.37 | 147.32,39.37 R33.2 148.97,38.99 R32.1 | C28.2 147.32,39.37
N$25
  Bottom 0.61: IC7.5 146.05,34.29 149.86,30.48 C27.1 151.51,28.37 153.4,26.48 153.4,21.98 R34.1
N$26
  Bottom 0.61: IC8.1 IC8.2 160.02,29.21 161.29,30.48 166.37,30.48 168.02,28.83 R37.2
N$27
  Bottom 0.61: R36.2 161.29,24.13 162.56,25.4 IC8.3 | C29.1 157.48,22.86 R36.2 | R35.1 154.69,26.92 R36.2
N$28
  Bottom 0.61: IC8.6 162.56,36.83 165.1,39.37 166.37,39.37 | 166.37,39.37 R38.2 168.02,38.99 R37.1 | C37.2 166.37,39.37
N$29
  Bottom 0.61: IC8.5 165.1,34.29 169.04,30.35 C36.1 170.61,30.35 172.42,28.55 172.42,23.83 171.45,22.86 R39.1
N$30
  Top 0.508: P1.5-MOSI 111.76,47.12 112.43,46.45 IC3.15
  Bottom 0.61: JP1.5 108.33,54.99 111.76,51.56 P1.5-MOSI
N$31
  Bottom 0.61: LED1.A R40.1
N$32
  Top 0.508: P2.3-SCK 127,60.96 128.52,62.48 146.81,62.48 152.65,56.65 IC5.17
  Bottom 0.61: JP1.2 114.15,64.24 125.83,64.24 127,63.07 P2.3-SCK
N$33
  Top 0.508: P2.4-MISO 124.46,60.96 127.13,63.63 151,63.63 155.57,59.06 IC5.16
  Bottom 0.61: JP1.4 112.14,58.42 113.03,59.31 113.03,60.83 115.06,62.87 123.19,62.87 124.46,61.59 P2.4-MISO
N$34
  Top 0.508: P2.5-MOSI 121.92,60.96 125.73,64.77 151.38,64.77 156.37,59.79 IC5.15
  Bottom 0.61: P2.5-MOSI 121.92,58.17 119.63,55.88 JP1.6
N$35
  Bottom 0.508: R43.2 137.92,15.24 R44.2
  Bottom 0.61: X5.3 R43.2
N$36
  Top 0.813: IC10.4 24.56,27.1 26.42,28.96 R45.2 R46.1
N$37
  Top 0.813: IC10.2 21.4,23.7 D3.C 26.28,24.52 27.28,23.52 L2.1
RS485A
  Top 0.508: R3.1 R41.2 126.37,19.05 128.27,19.05 128.91,19.69 IC2.6
  Bottom 0.61: R3.1 123.57,16.89 120.65,13.97 116.84,13.97 112.4,9.53 X7.2
RS485B
  Top 0.508: IC2.7 130.18,18.41 127,15.24 123.19,15.24 121.03,13.08 R42.2
  Bottom 0.61: R41.1 124.33,9.4 122.81,9.4 R42.2 117.86,11.18 116.21,9.53 X7.3
RXD
  Top 0.508: IC2.1 131.44,25.15 131.06,24.77 126.62,24.77 125.86,25.53 121.92,25.53 115.63,31.82 IC3.30
SINALIZA
  Top 0.508: IC3.12 114.83,45.61 118.75,49.53 123.7,49.53 R40.2
TEMP_IN
  Top 0.508: IC5.27 157.17,45.28 154.43,42.55 C34.+
  Bottom 0.508: R44.1 132.08,16.51 132.08,34.29 139.7,41.91 139.7,43.18 140.97,44.45 151.13,44.45 153.42,42.16 C34.+
TXD
  Top 0.508: IC3.31 116.43,33.02 116.43,32.8 116.43,32.64 120.75,28.32 127.13,28.32 127.63,27.81 IC2.4
TXE
  Top 0.508: IC3.2 119.86,38.39 128.91,29.34 | IC2.3 128.91,29.34 | IC2.2 130.18,28.07 128.91,29.34
VC1
  Bottom 0.61: X2.2 52.07,8.26 R4.2
VC2
  Bottom 0.61: X2.3 57.15,8.26 R6.2
VC3
  Bottom 0.61: R8.2 62.23,9.53 X2.4
VC4
  Bottom 0.61: R10.2 67.31,9.53 X1.1
VC5
  Bottom 0.61: X1.2 72.39,8.26 R12.2
VC6
  Bottom 0.61: X1.3 77.47,8.26 R14.2
VC7
  Bottom 0.61: R16.2 82.55,9.53 X1.4
VC8
  Bottom 0.61: R18.2 87.63,9.53 X6.1
VC9
  Bottom 0.61: X6.2 92.71,8.26 R20.2
VC10
  Bottom 0.61: X6.3 97.79,8.26 R22.2
VIN
  Bottom 0.813: X8.1 23.5,8.89 D2.A

### Text on the board
Top: Kerschbaumer | IFC | Luzerna